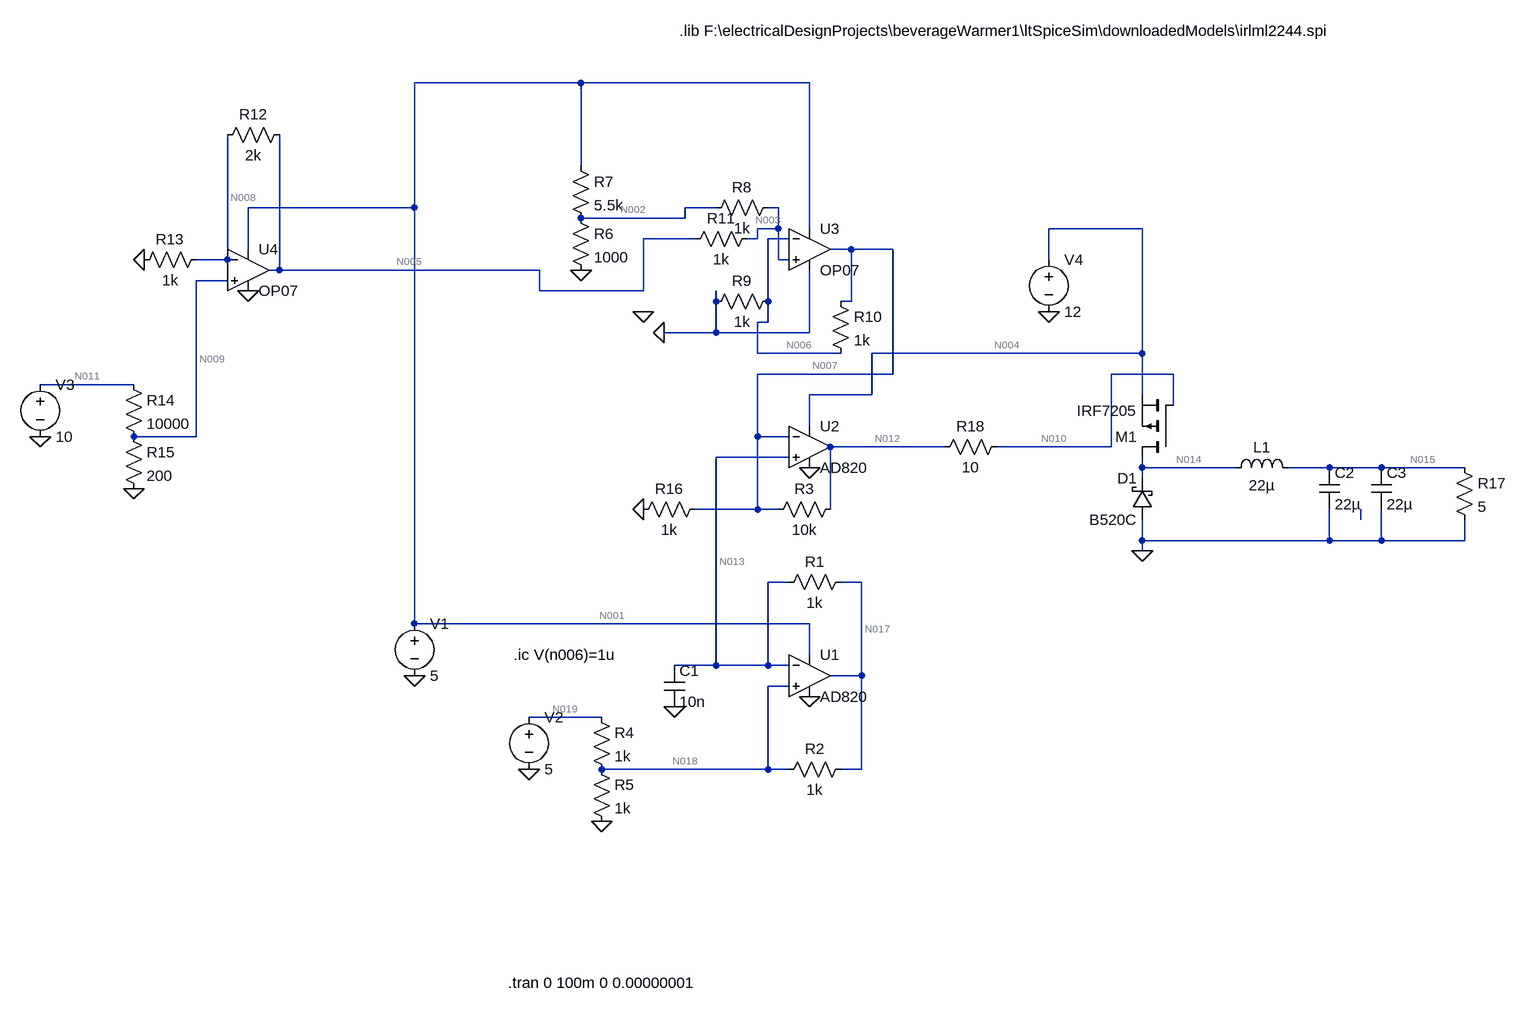
[diagram p0: schematic pwmSim1.asc]
pwmSim1.asc, the LTspice schematic file:
Version 4
SHEET 1 1300 680
WIRE -128 -784 -384 -784
WIRE 224 -784 -128 -784
WIRE -128 -656 -128 -784
WIRE -384 -592 -384 -784
WIRE -384 -592 -640 -592
WIRE 80 -592 32 -592
WIRE 176 -592 160 -592
WIRE 32 -576 32 -592
WIRE 32 -576 -128 -576
WIRE 176 -560 176 -592
WIRE 176 -560 144 -560
WIRE 224 -560 224 -784
WIRE 736 -560 592 -560
WIRE 48 -544 -32 -544
WIRE 144 -544 144 -560
WIRE 144 -544 128 -544
WIRE 192 -544 160 -544
WIRE -640 -528 -640 -592
WIRE 288 -528 256 -528
WIRE 352 -528 288 -528
WIRE -672 -512 -672 -704
WIRE -672 -512 -720 -512
WIRE 176 -512 176 -560
WIRE 192 -512 176 -512
WIRE 592 -512 592 -560
WIRE -592 -496 -592 -704
WIRE -592 -496 -608 -496
WIRE -192 -496 -592 -496
WIRE -672 -480 -720 -480
WIRE -192 -464 -192 -496
WIRE -32 -464 -32 -544
WIRE -32 -464 -192 -464
WIRE 80 -448 80 -464
WIRE 160 -448 160 -544
WIRE 288 -448 288 -528
WIRE 288 -448 272 -448
WIRE 160 -416 160 -448
WIRE 160 -416 144 -416
WIRE 80 -400 80 -448
WIRE 80 -400 0 -400
WIRE 224 -400 224 -496
WIRE 224 -400 80 -400
WIRE 144 -368 144 -416
WIRE 272 -368 144 -368
WIRE 736 -368 736 -560
WIRE 736 -368 320 -368
WIRE 352 -336 352 -528
WIRE 352 -336 144 -336
WIRE 784 -336 688 -336
WIRE -816 -320 -960 -320
WIRE 320 -304 320 -368
WIRE 320 -304 224 -304
WIRE 736 -304 736 -368
WIRE 784 -288 784 -336
WIRE 224 -256 224 -304
WIRE -720 -240 -720 -480
WIRE -720 -240 -816 -240
WIRE 144 -240 144 -336
WIRE 192 -240 144 -240
WIRE 432 -224 256 -224
WIRE 688 -224 688 -336
WIRE 688 -224 512 -224
WIRE 192 -208 80 -208
WIRE 736 -192 736 -208
WIRE 880 -192 736 -192
WIRE 1024 -192 960 -192
WIRE 1104 -192 1024 -192
WIRE 1232 -192 1104 -192
WIRE 736 -176 736 -192
WIRE 144 -128 144 -240
WIRE 144 -128 48 -128
WIRE 176 -128 144 -128
WIRE 256 -128 256 -224
WIRE 1072 -112 1072 -128
WIRE 736 -80 736 -112
WIRE 1024 -80 1024 -128
WIRE 1024 -80 736 -80
WIRE 1104 -80 1104 -128
WIRE 1104 -80 1024 -80
WIRE 1232 -80 1232 -112
WIRE 1232 -80 1104 -80
WIRE 736 -64 736 -80
WIRE 192 -16 160 -16
WIRE 304 -16 272 -16
WIRE -384 48 -384 -592
WIRE 224 48 -384 48
WIRE 224 96 224 48
WIRE 80 112 80 -208
WIRE 80 112 16 112
WIRE 160 112 160 -16
WIRE 160 112 80 112
WIRE 192 112 160 112
WIRE 304 128 304 -16
WIRE 304 128 256 128
WIRE 192 144 160 144
WIRE -96 192 -208 192
WIRE 160 272 160 144
WIRE 160 272 -96 272
WIRE 192 272 160 272
WIRE 304 272 304 128
WIRE 304 272 272 272
FLAG 16 176 0
FLAG 224 160 0
FLAG -96 352 0
FLAG -208 272 0
FLAG -384 128 0
FLAG 224 -192 0
FLAG -32 -432 0
FLAG 0 -400 0
FLAG -128 -496 0
FLAG -640 -464 0
FLAG -800 -512 0
FLAG -816 -160 0
FLAG -960 -240 0
FLAG -32 -128 0
FLAG 592 -432 0
FLAG 736 -64 0
SYMBOL cap 0 112 R0
SYMATTR InstName C1
SYMATTR Value 10n
SYMBOL res 288 -32 R90
WINDOW 0 0 56 VBottom 2
WINDOW 3 32 56 VTop 2
SYMATTR InstName R1
SYMATTR Value 1k
SYMBOL voltage -384 32 R0
WINDOW 123 0 0 Left 0
WINDOW 39 0 0 Left 0
SYMATTR InstName V1
SYMATTR Value 5
SYMBOL voltage -208 176 R0
WINDOW 123 0 0 Left 0
WINDOW 39 0 0 Left 0
SYMATTR InstName V2
SYMATTR Value 5
SYMBOL res -112 176 R0
SYMATTR InstName R4
SYMATTR Value 1k
SYMBOL res -112 256 R0
SYMATTR InstName R5
SYMATTR Value 1k
SYMBOL res 288 256 R90
WINDOW 0 0 56 VBottom 2
WINDOW 3 32 56 VTop 2
SYMATTR InstName R2
SYMATTR Value 1k
SYMBOL res -144 -592 R0
SYMATTR InstName R6
SYMATTR Value 1000
SYMBOL res -144 -672 R0
SYMATTR InstName R7
SYMATTR Value 5.5k
SYMBOL res 256 -464 R0
SYMATTR InstName R10
SYMATTR Value 1k
SYMBOL res 176 -608 R90
WINDOW 0 0 56 VBottom 2
WINDOW 3 32 56 VTop 2
SYMATTR InstName R8
SYMATTR Value 1k
SYMBOL res 176 -464 R90
WINDOW 0 0 56 VBottom 2
WINDOW 3 32 56 VTop 2
SYMATTR InstName R9
SYMATTR Value 1k
SYMBOL res 144 -560 R90
WINDOW 0 0 56 VBottom 2
WINDOW 3 32 56 VTop 2
SYMATTR InstName R11
SYMATTR Value 1k
SYMBOL res -576 -720 R90
WINDOW 0 0 56 VBottom 2
WINDOW 3 32 56 VTop 2
SYMATTR InstName R12
SYMATTR Value 2k
SYMBOL res -704 -528 R90
WINDOW 0 0 56 VBottom 2
WINDOW 3 32 56 VTop 2
SYMATTR InstName R13
SYMATTR Value 1k
SYMBOL voltage -960 -336 R0
WINDOW 123 0 0 Left 0
WINDOW 39 0 0 Left 0
SYMATTR InstName V3
SYMATTR Value 10
SYMBOL res -832 -336 R0
SYMATTR InstName R14
SYMATTR Value 10000
SYMBOL res -832 -256 R0
SYMATTR InstName R15
SYMATTR Value 200
SYMBOL res 272 -144 R90
WINDOW 0 0 56 VBottom 2
WINDOW 3 32 56 VTop 2
SYMATTR InstName R3
SYMATTR Value 10k
SYMBOL res 64 -144 R90
WINDOW 0 0 56 VBottom 2
WINDOW 3 32 56 VTop 2
SYMATTR InstName R16
SYMATTR Value 1k
SYMBOL OpAmps\\OP07 224 -592 R0
SYMATTR InstName U3
SYMBOL OpAmps\\OP07 -640 -560 R0
SYMATTR InstName U4
SYMBOL OpAmps\\AD820 224 -288 R0
SYMATTR InstName U2
SYMBOL OpAmps\\AD820 224 64 R0
SYMATTR InstName U1
SYMBOL voltage 592 -528 R0
WINDOW 123 0 0 Left 0
WINDOW 39 0 0 Left 0
SYMATTR InstName V4
SYMATTR Value 12
SYMBOL ind 864 -176 R270
WINDOW 0 32 56 VTop 2
WINDOW 3 5 56 VBottom 2
SYMATTR InstName L1
SYMATTR Value 22µ
SYMBOL cap 1008 -192 R0
SYMATTR InstName C2
SYMATTR Value 22µ
SYMBOL schottky 752 -112 R180
WINDOW 0 24 64 Left 2
WINDOW 3 24 0 Left 2
SYMATTR InstName D1
SYMATTR Value B520C
SYMBOL pmos 784 -208 R180
SYMATTR InstName M1
SYMATTR Value IRF7205
SYMBOL res 528 -240 R90
WINDOW 0 0 56 VBottom 2
WINDOW 3 32 56 VTop 2
SYMATTR InstName R18
SYMATTR Value 10
SYMBOL res 1216 -208 R0
SYMATTR InstName R17
SYMATTR Value 5
SYMBOL cap 1088 -192 R0
SYMATTR InstName C3
SYMATTR Value 22µ
TEXT -240 600 Left 2 !.tran 0 100m 0 0.00000001
TEXT -232 96 Left 2 !.ic V(n006)=1u
TEXT 24 -864 Left 2 !.lib F:\\electricalDesignProjects\\beverageWarmer1\\ltSpiceSim\\downloadedModels\\irlml2244.spi

The netlist it stands for:
* pwmSim1.asc
C1 N013 0 10n
R1 N017 N013 1k
V1 N001 0 5
V2 N019 0 5
R4 N019 N018 1k
R5 N018 0 1k
R2 N017 N018 1k
R6 N002 0 1000
R7 N001 N002 5.5k
R10 N007 N006 1k
R8 N003 N002 1k
R9 N006 0 1k
R11 N003 N005 1k
R12 N005 N008 2k
R13 N008 0 1k
V3 N011 0 10
R14 N011 N009 10000
R15 N009 0 200
R3 N012 N007 10k
R16 N007 0 1k
XU3 N003 N006 N001 0 N007 LT1001  ; OP07, pins In+ In- V+ V- OUT
XU4 N009 N008 N001 0 N005 LT1001  ; OP07, pins In+ In- V+ V- OUT
XU2 N013 N007 N004 0 N012 AD820  ; pins In+ In- V+ V- OUT
XU1 N018 N013 N001 0 N017 AD820  ; pins In+ In- V+ V- OUT
V4 N004 0 12
L1 N014 N015 22µ
C2 N015 0 22µ
D1 0 N014 B520C
M1 N014 N010 N004 N004 IRF7205
R18 N010 N012 10
R17 N015 0 5
C3 N015 0 22µ
.model D D
.lib standard.dio
.model NMOS NMOS
.model PMOS PMOS
.lib standard.mos
.tran 0 100m 0 0.00000001
.ic V(n006)=1u
.lib F:\electricalDesignProjects\beverageWarmer1\ltSpiceSim\downloadedModels\irlml2244.spi
.lib LTC.lib
.backanno
.end

* Results of the author's LTspice run, read from the files saved beside the schematic
* Operating Point, zero values left out:
*   V(n013) = 2.5 V
*   V(n017) = 2.5 V
*   V(n001) = 5 V
*   V(n019) = 5 V
*   V(n018) = 2.5 V
*   V(n002) = 814.9 mV
*   V(n007) = 3.782 V
*   V(n006) = 1 µV
*   V(n003) = 868.9 mV
*   V(n005) = 922.8 mV
*   V(n008) = 307.6 mV
*   V(n011) = 10 V
*   V(n009) = 196.1 mV
*   V(n012) = -13.14 mV
*   V(n004) = 12 V
*   V(n014) = 11.86 V
*   V(n015) = 11.86 V
*   V(n010) = -13.14 mV
*   Id(M1) = -2.373 A
*   Is(M1) = 2.373 A
*   I(D1) = -917.3 µA
*   I(L1) = 2.372 A
*   I(R17) = 2.372 A
*   I(R16) = 3.782 mA
*   I(R3) = -379.5 µA
*   I(R15) = 980.4 µA
*   I(R14) = 980.4 µA
*   I(R13) = 307.6 µA
*   I(R12) = 307.6 µA
*   I(R11) = -53.98 µA
*   I(R9) = 1 nA
*   I(R8) = 53.96 µA
*   I(R10) = 3.782 mA
*   I(R7) = 760.9 µA
*   I(R6) = 814.9 µA
*   I(R2) = 3.729 pA
*   I(R5) = 2.5 mA
*   I(R4) = 2.5 mA
*   I(R1) = 3.729 pA
*   I(V4) = -2.374 A
*   I(V3) = -980.4 µA
*   I(V2) = -2.5 mA
*   I(V1) = -11.83 mA